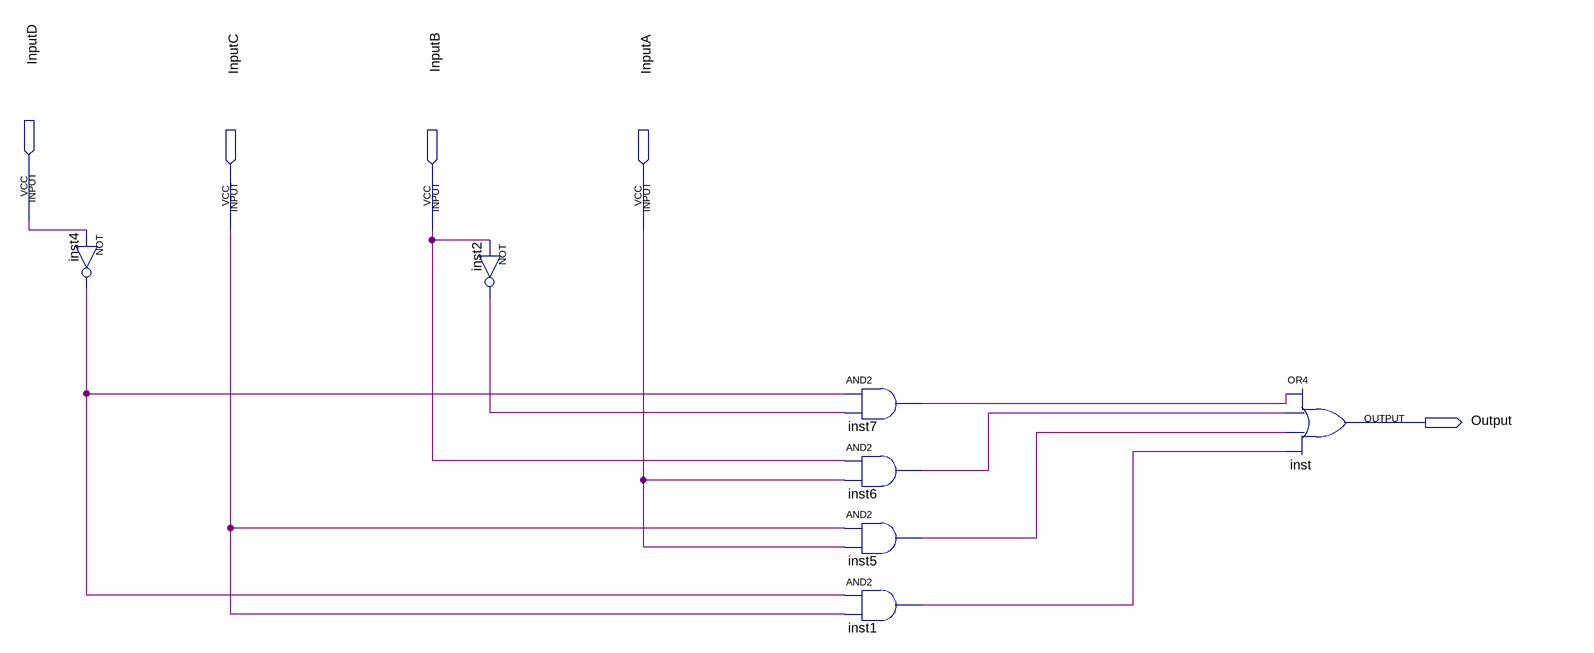
[diagram p0: schematic sheet]
// Quartus schematic SegE.bdf as structural Verilog: 7 symbols, 5 pins
module SegE (
  input  InputD,
  input  InputC,
  input  InputB,
  input  InputA,
  output Output
);

  wire inst1_out, inst2_out, inst4_out, inst5_out, inst6_out, inst7_out;

  not inst4 (inst4_out, InputD);
  not inst2 (inst2_out, InputB);
  and inst7 (inst7_out, inst4_out, inst2_out);
  and inst6 (inst6_out, InputB, InputA);
  and inst5 (inst5_out, InputC, InputA);
  and inst1 (inst1_out, inst4_out, InputC);
  or inst (Output, inst7_out, inst6_out, inst5_out, inst1_out);
endmodule
